# EAGLE design pi-pots (EAGLE 6.6.0)
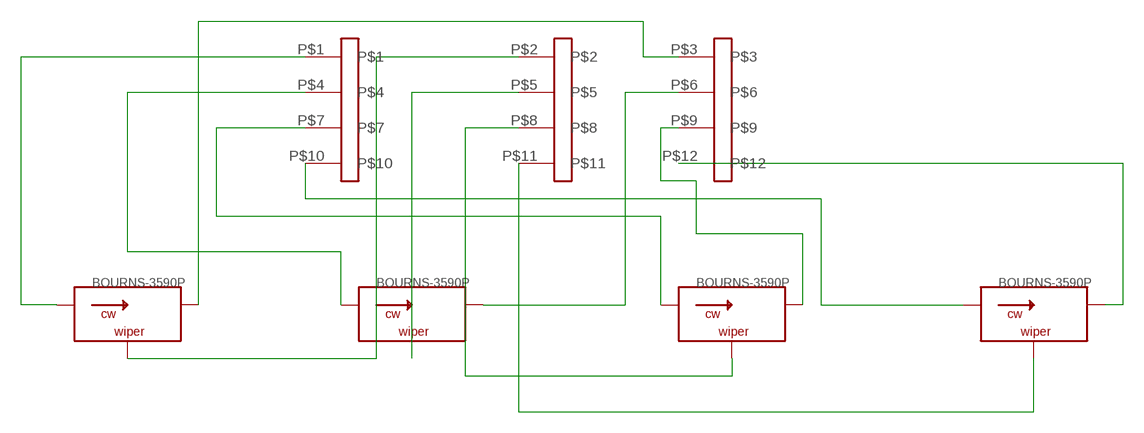
[diagram p0: schematic, sheet 1]

## Parts
I_GAIN  BOURNS-3590P  [3590P]
J1  PINHD-3X4  [3X04]
OUTPUT_OFFSET  BOURNS-3590P  [3590P]
P_GAIN  BOURNS-3590P  [3590P]
SWEEP_AMP  BOURNS-3590P  [3590P]

## Nets
N$1: J1.P$1 P_GAIN.1
N$2: I_GAIN.1 J1.P$4
N$3: J1.P$7 OUTPUT_OFFSET.1
N$4: J1.P$10 SWEEP_AMP.1
N$5: J1.P$2 P_GAIN.2
N$6: I_GAIN.2 J1.P$5
N$7: J1.P$8 OUTPUT_OFFSET.2
N$8: J1.P$11 SWEEP_AMP.2
N$9: J1.P$3 P_GAIN.3
N$10: I_GAIN.3 J1.P$6
N$11: J1.P$9 OUTPUT_OFFSET.3
N$12: J1.P$12 SWEEP_AMP.3

## Library data of the parts
I_GAIN OUTPUT_OFFSET P_GAIN SWEEP_AMP = pi-frontpanel:BOURNS-3590P; PARTNO: 3590P-1-103L-ND
J1 = pinhead:PINHD-3X4; PARTNO: 952-2121-ND (2x)

## Board
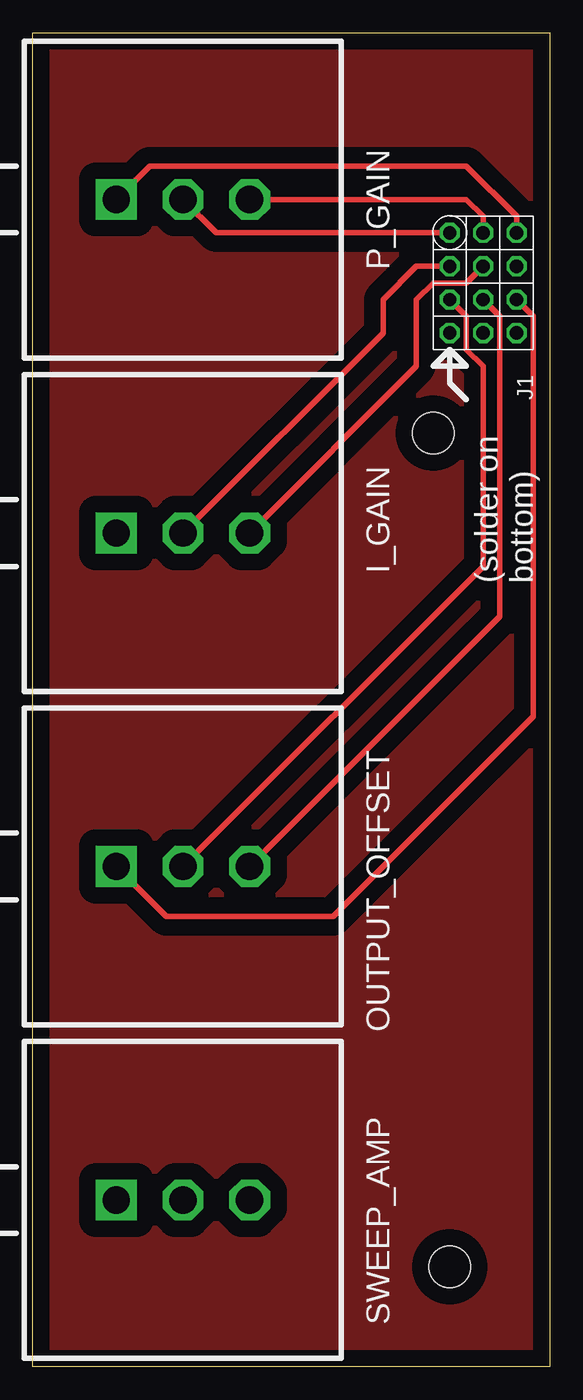
[diagram p1: board, top side]
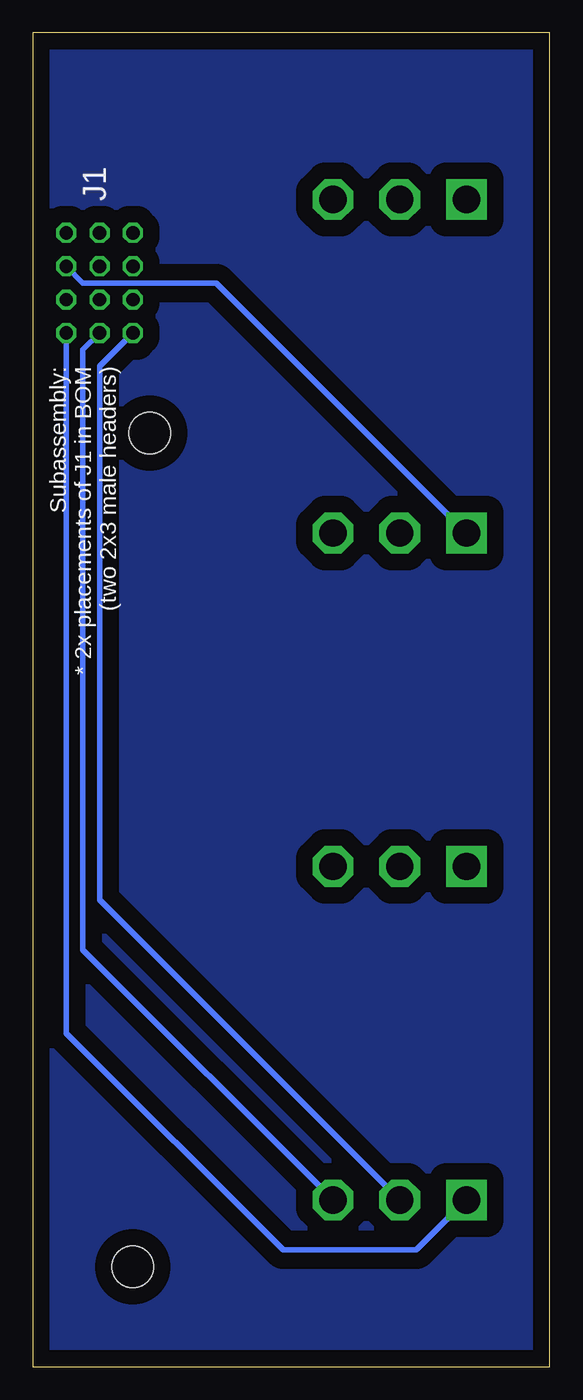
[diagram p2: board, bottom side, seen from below]

Size 39.37 x 101.6 mm. Coordinates in mm from the lower left corner, seen from the top.
Outline: 0,101.6 39.37,101.6 39.37,0 0,0 0,101.6
Copper layers (1*16): Top 0.035mm / dielectric 1.5mm / Bottom 0.035mm
Design rules "MF_Standard_2_Layer": minimum track width 5mil, minimum drill 10mil, track to track 5mil, track to pad 5mil, pad to pad 5mil, via to via 5mil, smd to smd 0mil, copper to edge 10mil, drill to drill 10mil, minimum pad ring 4mil, minimum via ring 4mil, stop-mask expansion 2mil, vias tented up to drill 25mil, thermal gap 10mil
Holes 3.17 mm at 30.48,71.12 31.75,7.62

### Footprints (pad centres in the part's own frame; a part is rotated, then mirrored left to right if it is on the bottom)
3590P = drill 2.083 octagon: 1 0,0; 2 -5.08,0 | drill 2.083 square: 3 5.08,0
3X04 = drill 1.016 octagon: P$1 -5.08,-2.54; P$2 -5.08,0; P$3 -5.08,2.54; P$4 -2.54,-2.54; P$5 -2.54,0; P$6 -2.54,2.54; P$7 0,-2.54; P$8 0,0; P$9 0,2.54; P$10 2.54,-2.54; P$11 2.54,0; P$12 2.54,2.54

### Placement (x,y rotation side)
I_GAIN  11.43,63.5 180 top
J1  34.29,81.28 270 top
OUTPUT_OFFSET  11.43,38.1 180 top
P_GAIN  11.43,88.9 180 top
SWEEP_AMP  11.43,12.7 180 top

### Tracks (layer width: path | path; a pad name or v marks a point on that pad's centre or on a via)
N$1
  Top 0.406: P_GAIN.1 13.97,86.36 J1.P$1
N$2
  Top 0.406: J1.P$4 29.21,83.82 26.67,81.28 26.67,78.74 I_GAIN.1
N$3
  Top 0.406: J1.P$7 33.02,80.01 33.02,77.47 34.29,76.2 34.29,60.96 OUTPUT_OFFSET.1
N$4
  Bottom 0.406: SWEEP_AMP.1 34.29,35.56 34.29,76.2 J1.P$10
N$5
  Top 0.406: P_GAIN.2 33.02,88.9 34.29,87.63 J1.P$2
N$6
  Top 0.406: J1.P$5 33.02,82.55 30.48,82.55 29.21,81.28 29.21,76.2 I_GAIN.2
N$7
  Top 0.406: J1.P$8 35.56,80.01 35.56,57.15 OUTPUT_OFFSET.2
N$8
  Bottom 0.406: SWEEP_AMP.2 35.56,31.75 35.56,77.47 J1.P$11
N$9
  Top 0.406: P_GAIN.3 8.89,91.44 33.02,91.44 36.83,87.63 J1.P$3
N$10
  Bottom 0.406: J1.P$6 35.56,82.55 25.4,82.55 I_GAIN.3
N$11
  Top 0.406: OUTPUT_OFFSET.3 10.16,34.29 22.86,34.29 38.1,49.53 38.1,80.01 J1.P$9
N$12
  Bottom 0.406: SWEEP_AMP.3 10.16,8.89 20.32,8.89 36.83,25.4 J1.P$12
N$13
  pour Bottom (isolate 1.27): 0,101.6 39.37,101.6 39.37,0 0,0
N$14
  pour Top (isolate 1.27): 0,101.6 39.37,101.6 39.37,0 0,0

### Text on the board
tPlace: (solder on / bottom)
bPlace: Subassembly: / * 2x placements of J1 in BOM / (two 2x3 male headers)
bNames: J1